# Altium schematic sheet Mechanical.SchDoc: Apalis Evaluation Board 1.1
size A3; Organization: Toradex AG; Address1: Altsagenstrasse 5; Address2: Horw; Address3: 6048; Address4: Switzerland; DocumentNumber: 32; Revision: V1.1; SheetNumber: 32; SheetTotal: 32; PageSetup: Record=PageOptions|CenterHorizontal=True|CenterVertical=True|PrintScale=0.73|XCorrection=1.00|YCorrection=1.00|PrintKind=0|BorderSize=5000000|LeftOffset=0|BottomOffset=0|Orientation=2|PaperLength=1000|PaperWidth=1000|Scale=100|PaperSource=7|PrintQuality=-4|MediaType=1|DitherType=10|PaperKind=A4|PrintScaleMode=1
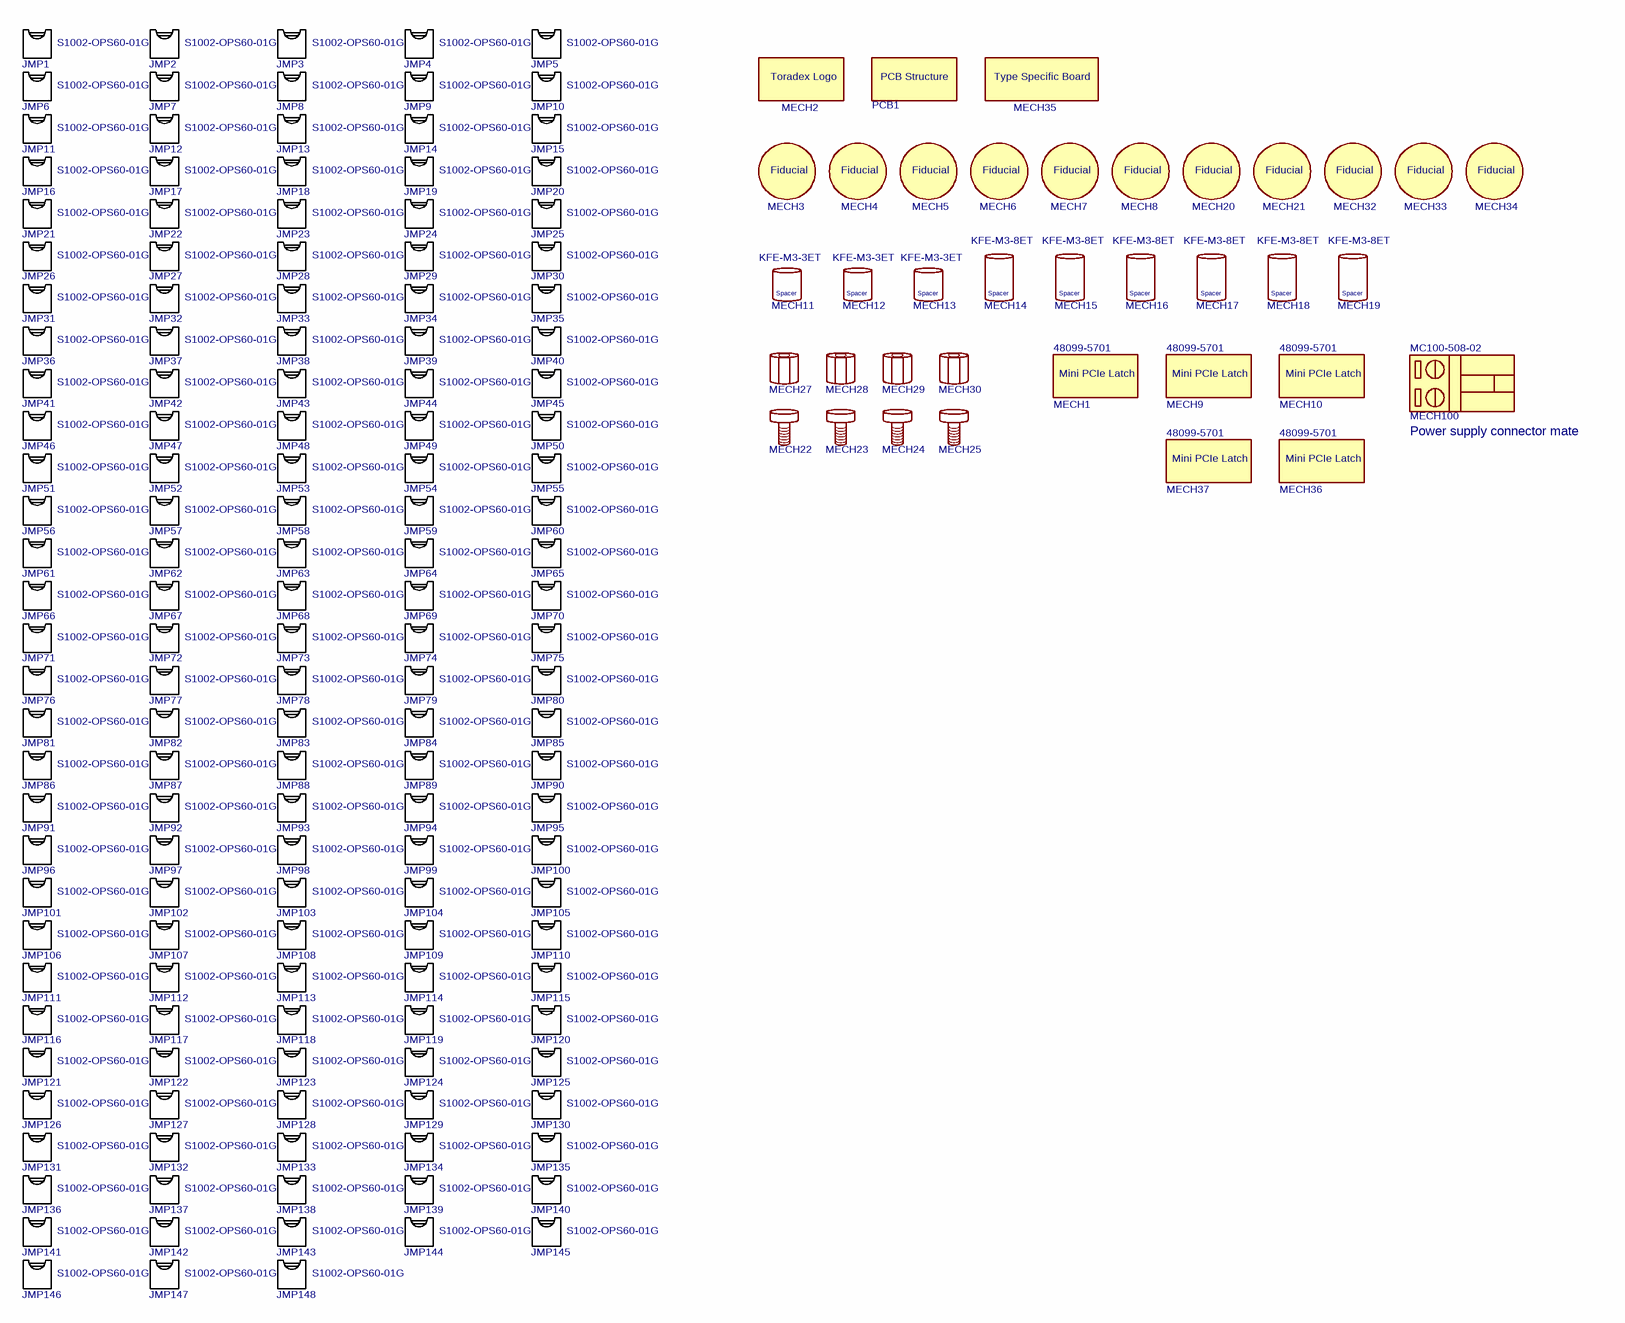
[diagram p0: Mechanical.SchDoc]

## Parts
JMP1  Manufacturer Part No.: S1002-OPS60-01G  (hidden comment: Shunt Jumper)
JMP2  Manufacturer Part No.: S1002-OPS60-01G  (hidden comment: Shunt Jumper)
JMP3  Manufacturer Part No.: S1002-OPS60-01G  (hidden comment: Shunt Jumper)
JMP4  Manufacturer Part No.: S1002-OPS60-01G  (hidden comment: Shunt Jumper)
JMP5  Manufacturer Part No.: S1002-OPS60-01G  (hidden comment: Shunt Jumper)
JMP6  Manufacturer Part No.: S1002-OPS60-01G  (hidden comment: Shunt Jumper)
JMP7  Manufacturer Part No.: S1002-OPS60-01G  (hidden comment: Shunt Jumper)
JMP8  Manufacturer Part No.: S1002-OPS60-01G  (hidden comment: Shunt Jumper)
JMP9  Manufacturer Part No.: S1002-OPS60-01G  (hidden comment: Shunt Jumper)
JMP10  Manufacturer Part No.: S1002-OPS60-01G  (hidden comment: Shunt Jumper)
JMP11  Manufacturer Part No.: S1002-OPS60-01G  (hidden comment: Shunt Jumper)
JMP12  Manufacturer Part No.: S1002-OPS60-01G  (hidden comment: Shunt Jumper)
JMP13  Manufacturer Part No.: S1002-OPS60-01G  (hidden comment: Shunt Jumper)
JMP14  Manufacturer Part No.: S1002-OPS60-01G  (hidden comment: Shunt Jumper)
JMP15  Manufacturer Part No.: S1002-OPS60-01G  (hidden comment: Shunt Jumper)
JMP16  Manufacturer Part No.: S1002-OPS60-01G  (hidden comment: Shunt Jumper)
JMP17  Manufacturer Part No.: S1002-OPS60-01G  (hidden comment: Shunt Jumper)
JMP18  Manufacturer Part No.: S1002-OPS60-01G  (hidden comment: Shunt Jumper)
JMP19  Manufacturer Part No.: S1002-OPS60-01G  (hidden comment: Shunt Jumper)
JMP20  Manufacturer Part No.: S1002-OPS60-01G  (hidden comment: Shunt Jumper)
JMP21  Manufacturer Part No.: S1002-OPS60-01G  (hidden comment: Shunt Jumper)
JMP22  Manufacturer Part No.: S1002-OPS60-01G  (hidden comment: Shunt Jumper)
JMP23  Manufacturer Part No.: S1002-OPS60-01G  (hidden comment: Shunt Jumper)
JMP24  Manufacturer Part No.: S1002-OPS60-01G  (hidden comment: Shunt Jumper)
JMP25  Manufacturer Part No.: S1002-OPS60-01G  (hidden comment: Shunt Jumper)
JMP26  Manufacturer Part No.: S1002-OPS60-01G  (hidden comment: Shunt Jumper)
JMP27  Manufacturer Part No.: S1002-OPS60-01G  (hidden comment: Shunt Jumper)
JMP28  Manufacturer Part No.: S1002-OPS60-01G  (hidden comment: Shunt Jumper)
JMP29  Manufacturer Part No.: S1002-OPS60-01G  (hidden comment: Shunt Jumper)
JMP30  Manufacturer Part No.: S1002-OPS60-01G  (hidden comment: Shunt Jumper)
JMP31  Manufacturer Part No.: S1002-OPS60-01G  (hidden comment: Shunt Jumper)
JMP32  Manufacturer Part No.: S1002-OPS60-01G  (hidden comment: Shunt Jumper)
JMP33  Manufacturer Part No.: S1002-OPS60-01G  (hidden comment: Shunt Jumper)
JMP34  Manufacturer Part No.: S1002-OPS60-01G  (hidden comment: Shunt Jumper)
JMP35  Manufacturer Part No.: S1002-OPS60-01G  (hidden comment: Shunt Jumper)
JMP36  Manufacturer Part No.: S1002-OPS60-01G  (hidden comment: Shunt Jumper)
JMP37  Manufacturer Part No.: S1002-OPS60-01G  (hidden comment: Shunt Jumper)
JMP38  Manufacturer Part No.: S1002-OPS60-01G  (hidden comment: Shunt Jumper)
JMP39  Manufacturer Part No.: S1002-OPS60-01G  (hidden comment: Shunt Jumper)
JMP40  Manufacturer Part No.: S1002-OPS60-01G  (hidden comment: Shunt Jumper)
JMP41  Manufacturer Part No.: S1002-OPS60-01G  (hidden comment: Shunt Jumper)
JMP42  Manufacturer Part No.: S1002-OPS60-01G  (hidden comment: Shunt Jumper)
JMP43  Manufacturer Part No.: S1002-OPS60-01G  (hidden comment: Shunt Jumper)
JMP44  Manufacturer Part No.: S1002-OPS60-01G  (hidden comment: Shunt Jumper)
JMP45  Manufacturer Part No.: S1002-OPS60-01G  (hidden comment: Shunt Jumper)
JMP46  Manufacturer Part No.: S1002-OPS60-01G  (hidden comment: Shunt Jumper)
JMP47  Manufacturer Part No.: S1002-OPS60-01G  (hidden comment: Shunt Jumper)
JMP48  Manufacturer Part No.: S1002-OPS60-01G  (hidden comment: Shunt Jumper)
JMP49  Manufacturer Part No.: S1002-OPS60-01G  (hidden comment: Shunt Jumper)
JMP50  Manufacturer Part No.: S1002-OPS60-01G  (hidden comment: Shunt Jumper)
JMP51  Manufacturer Part No.: S1002-OPS60-01G  (hidden comment: Shunt Jumper)
JMP52  Manufacturer Part No.: S1002-OPS60-01G  (hidden comment: Shunt Jumper)
JMP53  Manufacturer Part No.: S1002-OPS60-01G  (hidden comment: Shunt Jumper)
JMP54  Manufacturer Part No.: S1002-OPS60-01G  (hidden comment: Shunt Jumper)
JMP55  Manufacturer Part No.: S1002-OPS60-01G  (hidden comment: Shunt Jumper)
JMP56  Manufacturer Part No.: S1002-OPS60-01G  (hidden comment: Shunt Jumper)
JMP57  Manufacturer Part No.: S1002-OPS60-01G  (hidden comment: Shunt Jumper)
JMP58  Manufacturer Part No.: S1002-OPS60-01G  (hidden comment: Shunt Jumper)
JMP59  Manufacturer Part No.: S1002-OPS60-01G  (hidden comment: Shunt Jumper)
JMP60  Manufacturer Part No.: S1002-OPS60-01G  (hidden comment: Shunt Jumper)
JMP61  Manufacturer Part No.: S1002-OPS60-01G  (hidden comment: Shunt Jumper)
JMP62  Manufacturer Part No.: S1002-OPS60-01G  (hidden comment: Shunt Jumper)
JMP63  Manufacturer Part No.: S1002-OPS60-01G  (hidden comment: Shunt Jumper)
JMP64  Manufacturer Part No.: S1002-OPS60-01G  (hidden comment: Shunt Jumper)
JMP65  Manufacturer Part No.: S1002-OPS60-01G  (hidden comment: Shunt Jumper)
JMP66  Manufacturer Part No.: S1002-OPS60-01G  (hidden comment: Shunt Jumper)
JMP67  Manufacturer Part No.: S1002-OPS60-01G  (hidden comment: Shunt Jumper)
JMP68  Manufacturer Part No.: S1002-OPS60-01G  (hidden comment: Shunt Jumper)
JMP69  Manufacturer Part No.: S1002-OPS60-01G  (hidden comment: Shunt Jumper)
JMP70  Manufacturer Part No.: S1002-OPS60-01G  (hidden comment: Shunt Jumper)
JMP71  Manufacturer Part No.: S1002-OPS60-01G  (hidden comment: Shunt Jumper)
JMP72  Manufacturer Part No.: S1002-OPS60-01G  (hidden comment: Shunt Jumper)
JMP73  Manufacturer Part No.: S1002-OPS60-01G  (hidden comment: Shunt Jumper)
JMP74  Manufacturer Part No.: S1002-OPS60-01G  (hidden comment: Shunt Jumper)
JMP75  Manufacturer Part No.: S1002-OPS60-01G  (hidden comment: Shunt Jumper)
JMP76  Manufacturer Part No.: S1002-OPS60-01G  (hidden comment: Shunt Jumper)
JMP77  Manufacturer Part No.: S1002-OPS60-01G  (hidden comment: Shunt Jumper)
JMP78  Manufacturer Part No.: S1002-OPS60-01G  (hidden comment: Shunt Jumper)
JMP79  Manufacturer Part No.: S1002-OPS60-01G  (hidden comment: Shunt Jumper)
JMP80  Manufacturer Part No.: S1002-OPS60-01G  (hidden comment: Shunt Jumper)
JMP81  Manufacturer Part No.: S1002-OPS60-01G  (hidden comment: Shunt Jumper)
JMP82  Manufacturer Part No.: S1002-OPS60-01G  (hidden comment: Shunt Jumper)
JMP83  Manufacturer Part No.: S1002-OPS60-01G  (hidden comment: Shunt Jumper)
JMP84  Manufacturer Part No.: S1002-OPS60-01G  (hidden comment: Shunt Jumper)
JMP85  Manufacturer Part No.: S1002-OPS60-01G  (hidden comment: Shunt Jumper)
JMP86  Manufacturer Part No.: S1002-OPS60-01G  (hidden comment: Shunt Jumper)
JMP87  Manufacturer Part No.: S1002-OPS60-01G  (hidden comment: Shunt Jumper)
JMP88  Manufacturer Part No.: S1002-OPS60-01G  (hidden comment: Shunt Jumper)
JMP89  Manufacturer Part No.: S1002-OPS60-01G  (hidden comment: Shunt Jumper)
JMP90  Manufacturer Part No.: S1002-OPS60-01G  (hidden comment: Shunt Jumper)
JMP91  Manufacturer Part No.: S1002-OPS60-01G  (hidden comment: Shunt Jumper)
JMP92  Manufacturer Part No.: S1002-OPS60-01G  (hidden comment: Shunt Jumper)
JMP93  Manufacturer Part No.: S1002-OPS60-01G  (hidden comment: Shunt Jumper)
JMP94  Manufacturer Part No.: S1002-OPS60-01G  (hidden comment: Shunt Jumper)
JMP95  Manufacturer Part No.: S1002-OPS60-01G  (hidden comment: Shunt Jumper)
JMP96  Manufacturer Part No.: S1002-OPS60-01G  (hidden comment: Shunt Jumper)
JMP97  Manufacturer Part No.: S1002-OPS60-01G  (hidden comment: Shunt Jumper)
JMP98  Manufacturer Part No.: S1002-OPS60-01G  (hidden comment: Shunt Jumper)
JMP99  Manufacturer Part No.: S1002-OPS60-01G  (hidden comment: Shunt Jumper)
JMP100  Manufacturer Part No.: S1002-OPS60-01G  (hidden comment: Shunt Jumper)
JMP101  Manufacturer Part No.: S1002-OPS60-01G  (hidden comment: Shunt Jumper)
JMP102  Manufacturer Part No.: S1002-OPS60-01G  (hidden comment: Shunt Jumper)
JMP103  Manufacturer Part No.: S1002-OPS60-01G  (hidden comment: Shunt Jumper)
JMP104  Manufacturer Part No.: S1002-OPS60-01G  (hidden comment: Shunt Jumper)
JMP105  Manufacturer Part No.: S1002-OPS60-01G  (hidden comment: Shunt Jumper)
JMP106  Manufacturer Part No.: S1002-OPS60-01G  (hidden comment: Shunt Jumper)
JMP107  Manufacturer Part No.: S1002-OPS60-01G  (hidden comment: Shunt Jumper)
JMP108  Manufacturer Part No.: S1002-OPS60-01G  (hidden comment: Shunt Jumper)
JMP109  Manufacturer Part No.: S1002-OPS60-01G  (hidden comment: Shunt Jumper)
JMP110  Manufacturer Part No.: S1002-OPS60-01G  (hidden comment: Shunt Jumper)
JMP111  Manufacturer Part No.: S1002-OPS60-01G  (hidden comment: Shunt Jumper)
JMP112  Manufacturer Part No.: S1002-OPS60-01G  (hidden comment: Shunt Jumper)
JMP113  Manufacturer Part No.: S1002-OPS60-01G  (hidden comment: Shunt Jumper)
JMP114  Manufacturer Part No.: S1002-OPS60-01G  (hidden comment: Shunt Jumper)
JMP115  Manufacturer Part No.: S1002-OPS60-01G  (hidden comment: Shunt Jumper)
JMP116  Manufacturer Part No.: S1002-OPS60-01G  (hidden comment: Shunt Jumper)
JMP117  Manufacturer Part No.: S1002-OPS60-01G  (hidden comment: Shunt Jumper)
JMP118  Manufacturer Part No.: S1002-OPS60-01G  (hidden comment: Shunt Jumper)
JMP119  Manufacturer Part No.: S1002-OPS60-01G  (hidden comment: Shunt Jumper)
JMP120  Manufacturer Part No.: S1002-OPS60-01G  (hidden comment: Shunt Jumper)
JMP121  Manufacturer Part No.: S1002-OPS60-01G  (hidden comment: Shunt Jumper)
JMP122  Manufacturer Part No.: S1002-OPS60-01G  (hidden comment: Shunt Jumper)
JMP123  Manufacturer Part No.: S1002-OPS60-01G  (hidden comment: Shunt Jumper)
JMP124  Manufacturer Part No.: S1002-OPS60-01G  (hidden comment: Shunt Jumper)
JMP125  Manufacturer Part No.: S1002-OPS60-01G  (hidden comment: Shunt Jumper)
JMP126  Manufacturer Part No.: S1002-OPS60-01G  (hidden comment: Shunt Jumper)
JMP127  Manufacturer Part No.: S1002-OPS60-01G  (hidden comment: Shunt Jumper)
JMP128  Manufacturer Part No.: S1002-OPS60-01G  (hidden comment: Shunt Jumper)
JMP129  Manufacturer Part No.: S1002-OPS60-01G  (hidden comment: Shunt Jumper)
JMP130  Manufacturer Part No.: S1002-OPS60-01G  (hidden comment: Shunt Jumper)
JMP131  Manufacturer Part No.: S1002-OPS60-01G  (hidden comment: Shunt Jumper)
JMP132  Manufacturer Part No.: S1002-OPS60-01G  (hidden comment: Shunt Jumper)
JMP133  Manufacturer Part No.: S1002-OPS60-01G  (hidden comment: Shunt Jumper)
JMP134  Manufacturer Part No.: S1002-OPS60-01G  (hidden comment: Shunt Jumper)
JMP135  Manufacturer Part No.: S1002-OPS60-01G  (hidden comment: Shunt Jumper)
JMP136  Manufacturer Part No.: S1002-OPS60-01G  (hidden comment: Shunt Jumper)
JMP137  Manufacturer Part No.: S1002-OPS60-01G  (hidden comment: Shunt Jumper)
JMP138  Manufacturer Part No.: S1002-OPS60-01G  (hidden comment: Shunt Jumper)
JMP139  Manufacturer Part No.: S1002-OPS60-01G  (hidden comment: Shunt Jumper)
JMP140  Manufacturer Part No.: S1002-OPS60-01G  (hidden comment: Shunt Jumper)
JMP141  Manufacturer Part No.: S1002-OPS60-01G  (hidden comment: Shunt Jumper)
JMP142  Manufacturer Part No.: S1002-OPS60-01G  (hidden comment: Shunt Jumper)
JMP143  Manufacturer Part No.: S1002-OPS60-01G  (hidden comment: Shunt Jumper)
JMP144  Manufacturer Part No.: S1002-OPS60-01G  (hidden comment: Shunt Jumper)
JMP145  Manufacturer Part No.: S1002-OPS60-01G  (hidden comment: Shunt Jumper)
JMP146  Manufacturer Part No.: S1002-OPS60-01G  (hidden comment: Shunt Jumper)
JMP147  Manufacturer Part No.: S1002-OPS60-01G  (hidden comment: Shunt Jumper)
JMP148  Manufacturer Part No.: S1002-OPS60-01G  (hidden comment: Shunt Jumper)
MECH1  Manufacturer Part No.: 48099-5701  [T_Molex_48099-5701_MECH]  (hidden comment: MECH-Mini-PCIe Latch)
MECH2  MECH-Toradex_Logo  [T_TORADEX_LOGO]  (value not drawn)  (no BOM)
MECH3  MECH-Fiducial  [T_Fiducial]  (value not drawn)  (no BOM)
MECH4  MECH-Fiducial  [T_Fiducial]  (value not drawn)  (no BOM)
MECH5  MECH-Fiducial  [T_Fiducial]  (value not drawn)  (no BOM)
MECH6  MECH-Fiducial  [T_Fiducial]  (value not drawn)  (no BOM)
MECH7  MECH-Fiducial  [T_Fiducial]  (value not drawn)  (no BOM)
MECH8  MECH-Fiducial  [T_Fiducial]  (value not drawn)  (no BOM)
MECH9  Manufacturer Part No.: 48099-5701  [T_Molex_48099-5701_MECH]  (hidden comment: MECH-Mini-PCIe Latch)
MECH10  Manufacturer Part No.: 48099-5701  [T_Molex_48099-5701_MECH]  (hidden comment: MECH-Mini-PCIe Latch)
MECH11  KFE-M3-3ET
MECH12  KFE-M3-3ET
MECH13  KFE-M3-3ET
MECH14  KFE-M3-8ET
MECH15  KFE-M3-8ET
MECH16  KFE-M3-8ET
MECH17  KFE-M3-8ET
MECH18  KFE-M3-8ET
MECH19  KFE-M3-8ET
MECH20  MECH-Fiducial  [T_Fiducial]  (value not drawn)  (no BOM)
MECH21  MECH-Fiducial  [T_Fiducial]  (value not drawn)  (no BOM)
MECH22  M3-4N  (value not drawn)
MECH23  M3-4N  (value not drawn)
MECH24  M3-4N  (value not drawn)
MECH25  M3-4N  (value not drawn)
MECH27  HP-6  (value not drawn)
MECH28  HP-6  (value not drawn)
MECH29  HP-6  (value not drawn)
MECH30  HP-6  (value not drawn)
MECH32  MECH-Fiducial  [T_Fiducial]  (value not drawn)  (no BOM)
MECH33  MECH-Fiducial  [T_Fiducial]  (value not drawn)  (no BOM)
MECH34  MECH-Fiducial  [T_Fiducial]  (value not drawn)  (no BOM)
MECH35  MECH-TypeSpecific  [T_TYPE_SPECIFIC]  (value not drawn)  (no BOM)
MECH36  Manufacturer Part No.: 48099-5701  [T_Molex_48099-5701_MECH]  (hidden comment: MECH-Mini-PCIe Latch)
MECH37  Manufacturer Part No.: 48099-5701  [T_Molex_48099-5701_MECH]  (hidden comment: MECH-Mini-PCIe Latch)
MECH100  MC100-508-02
PCB1  PCB Apalis EvalBoard V1.1.001  (value not drawn)

## Notes on the sheet
- (near MECH100) Power supply connector mate
- Title
- Size:
- Date:
- A3
- Number:
- Time:
- Revision:
- Sheet
- of
- File:
- (in symbol MECH-HiTech-KFE-M3-3ET) Spacer
- (in symbol MECH-HiTech-KFE-M3-8ET) Spacer
- (in symbol MECH-Molex-48099-5701) Mini PCIe Latch
- (in symbol MECH-Toradex_Logo) Toradex Logo
- (in symbol MECH-TypeSpecific) Type Specific Board

## Library data of the parts
JMP1-JMP148 = MECH-Shunt-Jumper-Black-2.54mm: Manufacturer Name: JVE
MECH1 MECH9 MECH10 MECH36 MECH37 = MECH-Molex-48099-5701: Mini-PCIe Latch; Manufacturer Name: Molex
MECH2 = MECH-Toradex_Logo: Toradex_Logo
MECH3-MECH8 MECH20 MECH21 MECH32-MECH34 = MECH-Fiducial: Fiducial
MECH11-MECH13 = MECH-HiTech-KFE-M3-3ET: Spacer 3mm M3; Manufacturer Name: Hi-Tech Fasteners Inc; Manufacturer Part No.: KFE-M3-3ET
MECH14-MECH19 = MECH-HiTech-KFE-M3-8ET: Spacer 8mm M3; Manufacturer Name: Hi-Tech Fasteners Inc; Manufacturer Part No.: KFE-M3-8ET
MECH22-MECH25 = MECH-KangYang-M3-4N: Plastic Tapping Screw M3x4mm/-; Manufacturer Name: Kang Yang; Manufacturer Part No.: M3-4N
MECH27-MECH30 = MECH-KangYang-HP-6: Plastic Hexagonal Spacer 6 mm/-/-; Manufacturer Name: Kang Yang; Manufacturer Part No.: HP-6
MECH35 = MECH-TypeSpecific: PCB Structure
MECH100 = CON-DECA-MC100-508-02-1x2-Mate: Power Connector Mate; Manufacturer Name: DECA Switchlab; No. of ways: 1x2; Pitch: 5.08mm; Manufacturer Part No.: MC100-508-02
PCB1 = PCB Apalis EvalBoard V1.1.001: PCB Structure